# Altium project Boost_regulator.PrjPcb
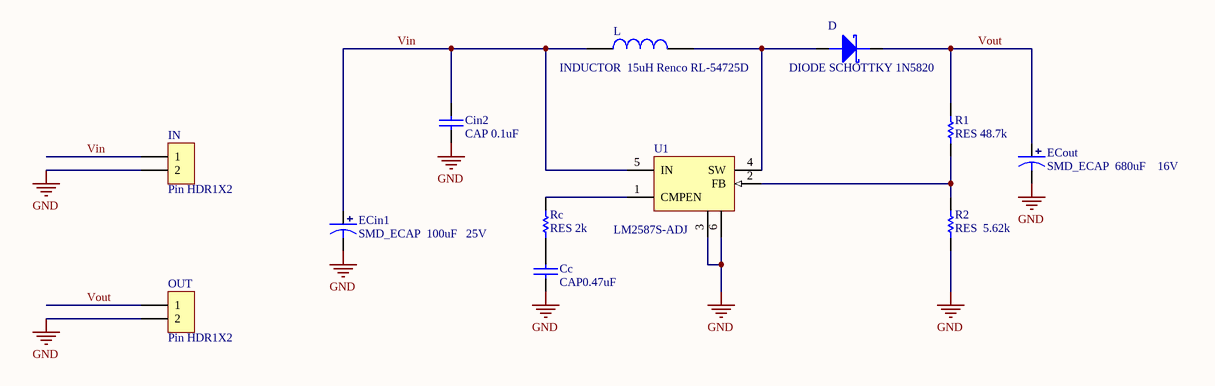
[diagram p0: Boost_regulator.SchDoc]
1 sheet, 12 parts. Net scope: global (net labels, ports and power ports of the same name join across sheets).
Board file: Boost_regulator.PcbDoc

## Sheet Boost_regulator.SchDoc
size A4

### Parts
Cc  CAP0.47uF  [0805C]
Cin2  CAP 0.1uF  [0805C]
D  DIODE SCHOTTKY 1N5820  [SMA/DO-214AC]
ECin1  SMD_ECAP  100uF   25V  [SMD-EC8X8X10]
ECout  SMD_ECAP  680uF    16V  [SMD-EC8X8X10]
IN  Pin HDR1X2  [Pin HDR1X2/2.54mm-S]
L  INDUCTOR  15uH Renco RL-54725D  [CDRH127]
OUT  Pin HDR1X2  [Pin HDR1X2/2.54mm-S]
R1  RES 48.7k  [0603R]
R2  RES  5.62k  [0603R]
Rc  RES 2k  [0603R]
U1  LM2587S-ADJ  [TO-263-5]

### Nets
GND: Cc.1 Cin2.1 ECin1.2 ECout.2 IN.2 OUT.2 R2.1 U1.3(GND) U1.6
Vin: Cin2.2 ECin1.1 IN.1 L.1 U1.5(IN)
Vout: D.K ECout.1 OUT.1 R1.2
NetCc_2: Cc.2 Rc.1
NetD_A: D.A L.2 U1.4(SW)
NetR1_1: R1.1 R2.2 U1.2(FB)
NetRc_2: Rc.2 U1.1(CMPEN)

### Library data of the parts
Cc Cin2 = CAP: 无极性电容
D = DIODE SCHOTTKY: 肖特基二极管
ECin1 ECout = SMD_ECAP: 贴片电解电容
L = INDUCTOR
R1 R2 Rc = RES
U1 = LM2577S-ADJ: DC升压; Note: Tab is connected to GND; Published: 15-Apr-2002; DatasheetVersion: Jun-1999; PackageVersion: 2000; PackageReference: T05A; Publisher: Altium Limited; PackageDescription: TO, Thru-Hole, Vertical, Heatsink Mounted; 5 In-Line Leads; Pitch 1.70 mm; Code_JEDEC: TS-001-AA; ComponentLink1Description: Manufacturer Link; ComponentLink1URL: http://www.national.com/; ComponentLink2Description: Datasheet; ComponentLink2URL: http://www.national.com/ds.cgi/LM/LM1577.pdf; ComponentLink3Description: URL Link1; ComponentLink3URL: http://www.national.com/pf/LM/LM2577.html